# EAGLE schematic nas-adapter-board (EAGLE 7.7.0)
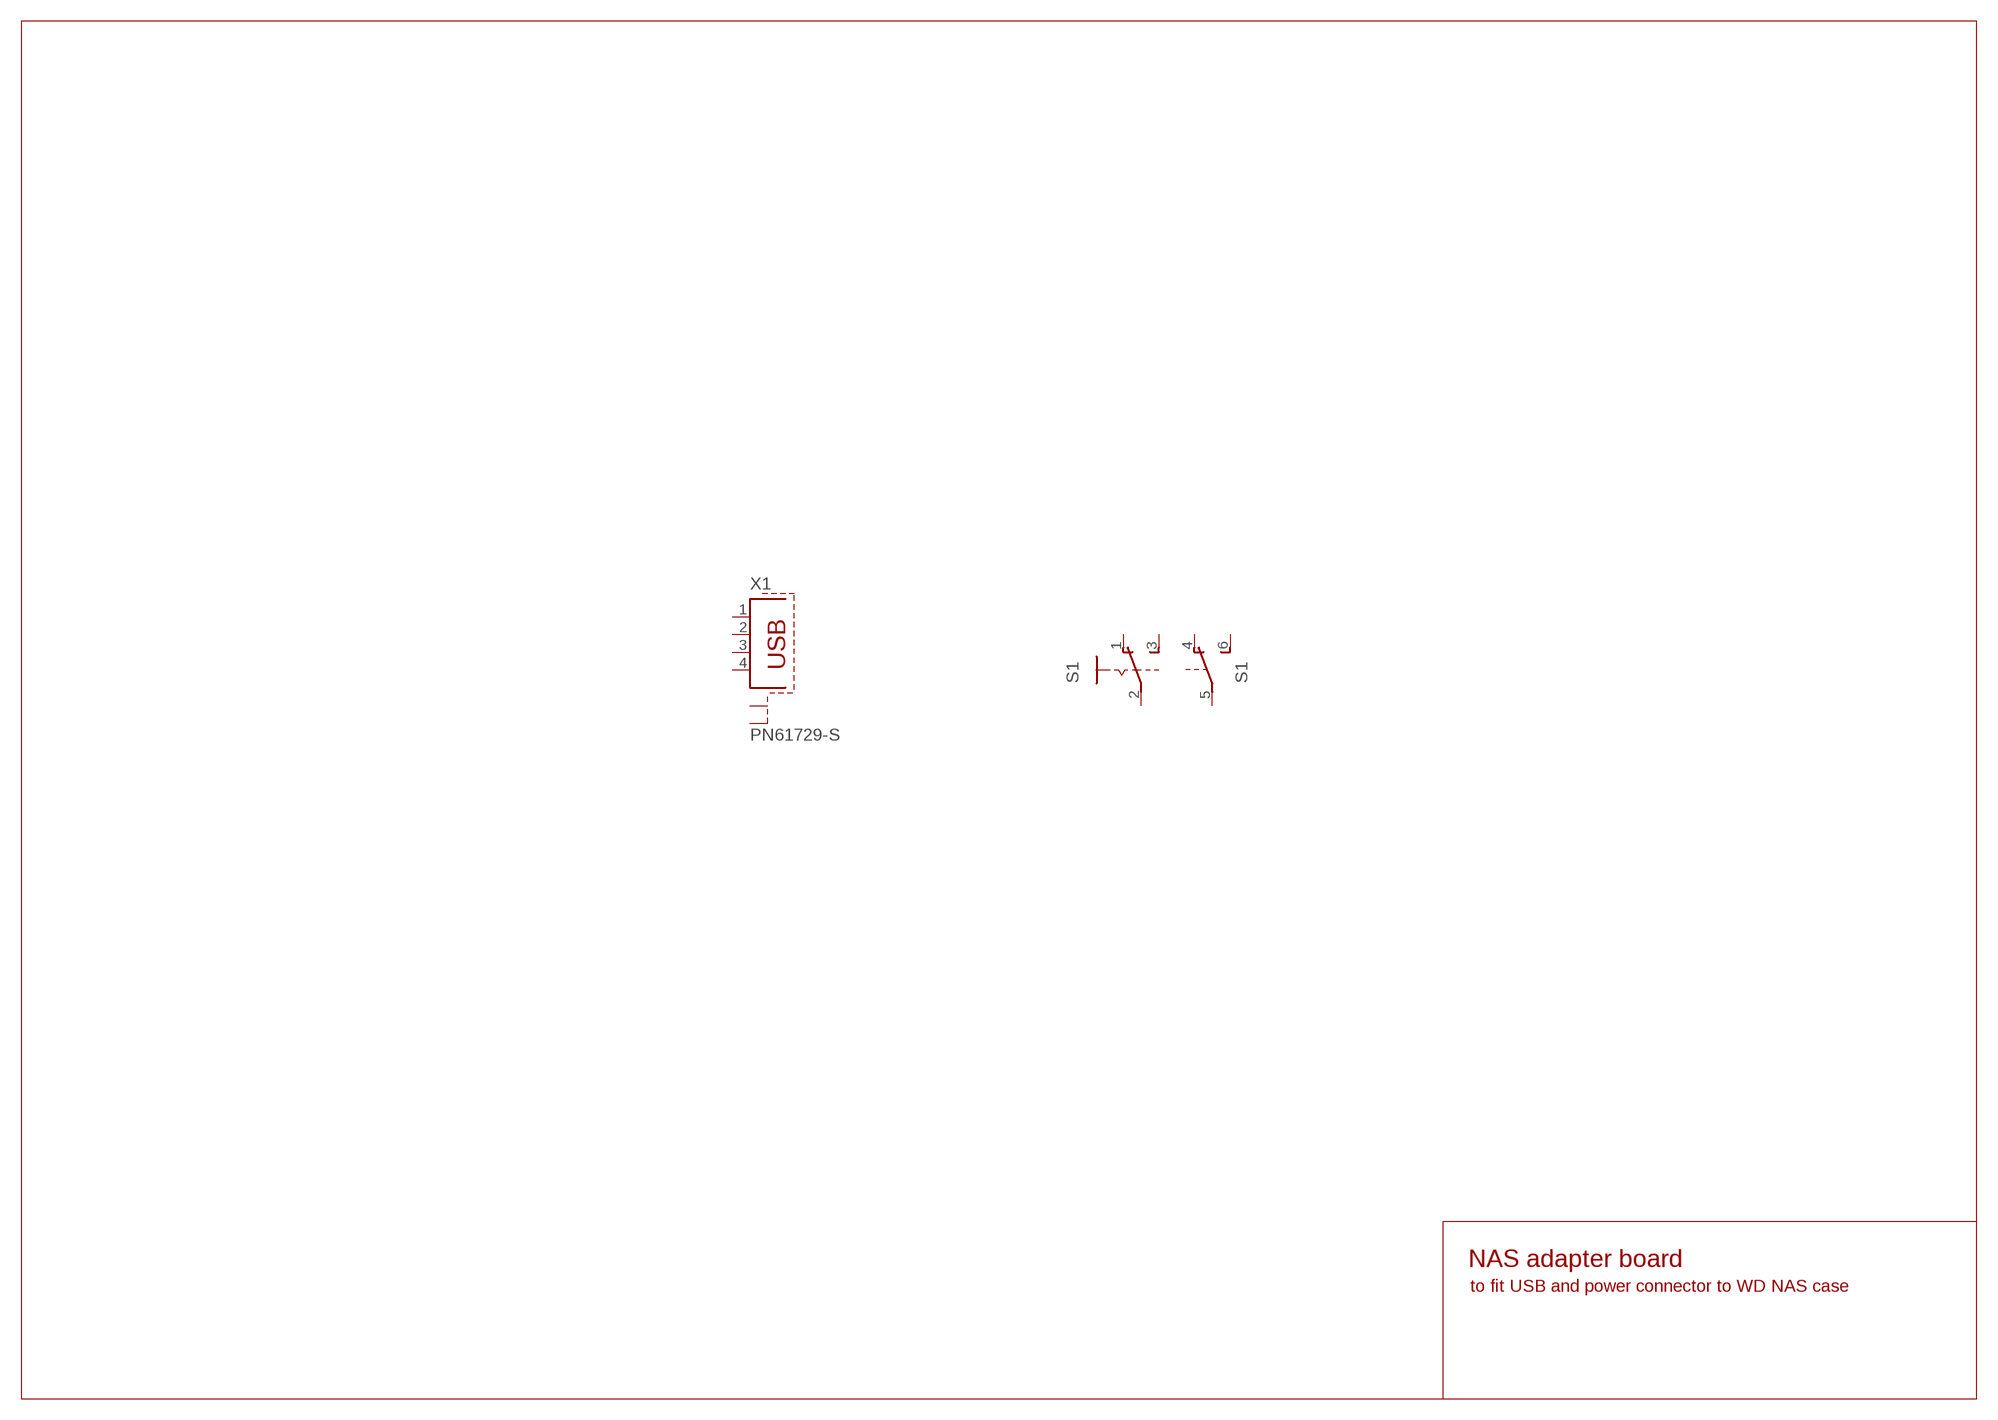
[diagram p0: schematic, sheet 1]

## Parts
S1  A68-A31  [A68-A31]
X1  PN61729-S  [PN61729-S]
Unconnected: S1.1(A:O) S1.2(A:P) S1.3(A:S) S1.4(B:O) S1.5(B:P) S1.6(B:S) X1.1 X1.2 X1.3 X1.4 X1.S1 X1.S2

## Notes on the sheet
- NAS adapter board
- to fit USB and power connector to WD NAS case

## Library data of the parts
S1 = switch:A68-A31: SLIDING SWITCH Siemens, distributor Buerklin, 11G766
X1 = con-berg:PN61729-S: BERG USB connector; OC_FARNELL: unknown; OC_NEWARK: unknown